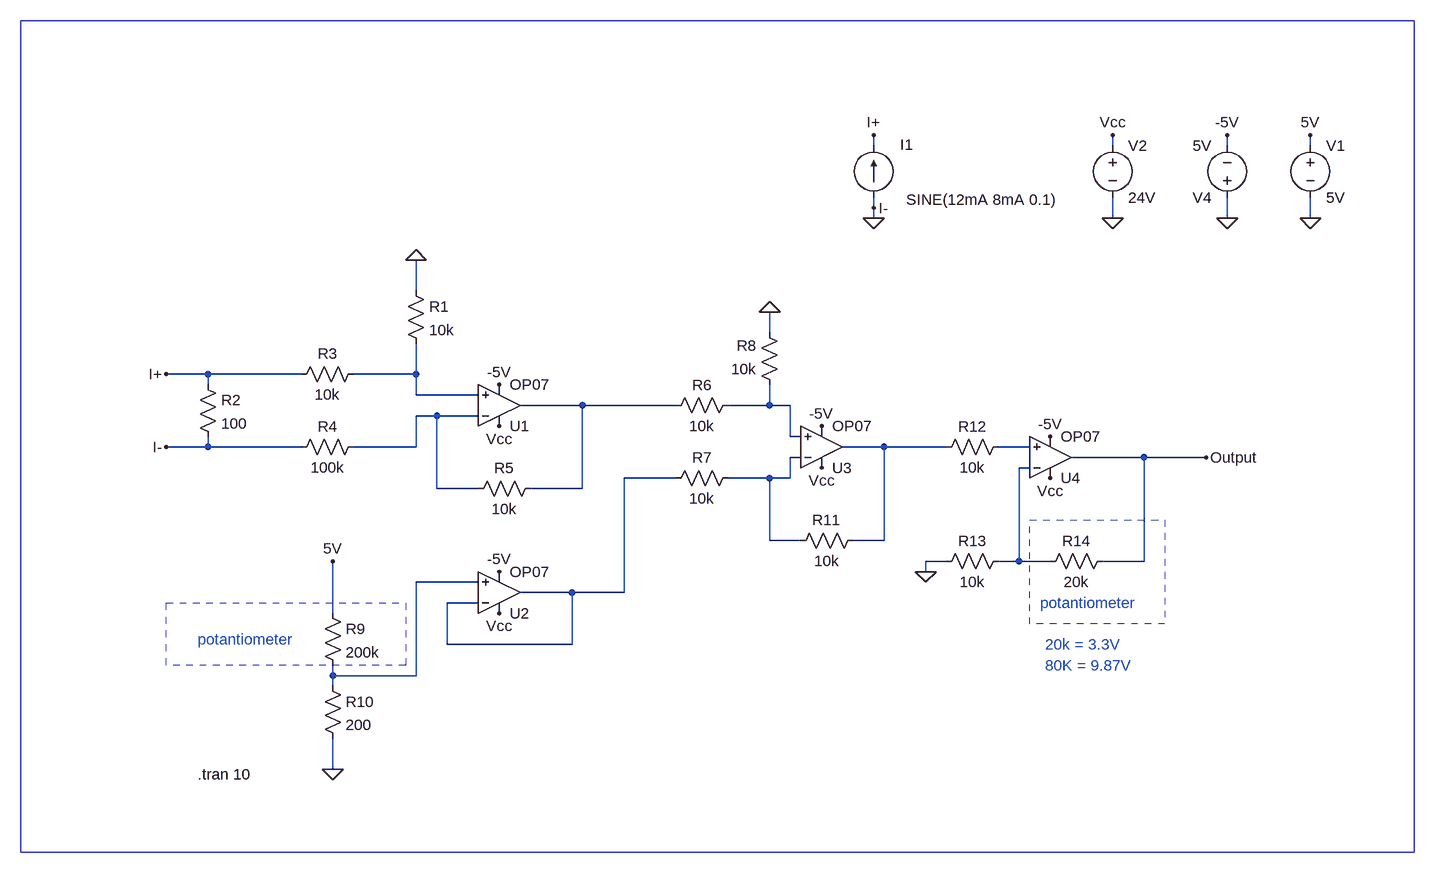
[diagram p0: schematic HW-685.asc]
HW-685.asc, the LTspice schematic file:
Version 4.1
SHEET 1 1764 868
WIRE 736 -224 736 -240
WIRE 1104 -224 1104 -240
WIRE 1280 -224 1280 -240
WIRE 1408 -224 1408 -240
WIRE 736 -128 736 -144
WIRE 736 -112 736 -128
WIRE 1104 -112 1104 -144
WIRE 1280 -112 1280 -144
WIRE 1408 -112 1408 -144
WIRE 32 0 32 -48
WIRE 576 64 576 32
WIRE -288 128 -352 128
WIRE -144 128 -288 128
WIRE 32 128 32 80
WIRE 32 128 -64 128
WIRE -288 144 -288 128
WIRE 32 160 32 128
WIRE 128 160 32 160
WIRE 288 176 192 176
WIRE 432 176 288 176
WIRE 576 176 576 144
WIRE 576 176 512 176
WIRE 608 176 576 176
WIRE 64 192 32 192
WIRE 128 192 64 192
WIRE 608 224 608 176
WIRE 624 224 608 224
WIRE -288 240 -288 224
WIRE -288 240 -352 240
WIRE -144 240 -288 240
WIRE 32 240 32 192
WIRE 32 240 -64 240
WIRE 752 240 688 240
WIRE 848 240 752 240
WIRE 976 240 928 240
WIRE 624 256 608 256
WIRE 1152 256 1040 256
WIRE 1248 256 1152 256
WIRE 976 272 960 272
WIRE 432 288 352 288
WIRE 576 288 512 288
WIRE 608 288 608 256
WIRE 608 288 576 288
WIRE 64 304 64 192
WIRE 128 304 64 304
WIRE 288 304 288 176
WIRE 288 304 208 304
WIRE 576 384 576 288
WIRE 624 384 576 384
WIRE 752 384 752 240
WIRE 752 384 704 384
WIRE 848 416 816 416
WIRE 960 416 960 272
WIRE 960 416 928 416
WIRE 1008 416 960 416
WIRE 1152 416 1152 256
WIRE 1152 416 1088 416
WIRE 816 432 816 416
WIRE 128 448 32 448
WIRE 272 464 192 464
WIRE 352 464 352 288
WIRE 352 464 272 464
WIRE 128 480 80 480
WIRE -96 496 -96 416
WIRE 80 544 80 480
WIRE 272 544 272 464
WIRE 272 544 80 544
WIRE -96 592 -96 576
WIRE 32 592 32 448
WIRE 32 592 -96 592
WIRE -96 608 -96 592
WIRE -96 736 -96 688
FLAG 32 -48 0
FLAG 576 32 0
FLAG -96 416 5V
FLAG -96 736 0
FLAG 816 432 0
FLAG 1248 256 Output
FLAG -352 128 I+
FLAG -352 240 I-
FLAG 736 -112 0
FLAG 736 -240 I+
FLAG 736 -128 I-
FLAG 1104 -240 Vcc
FLAG 1104 -112 0
FLAG 160 144 -5V
FLAG 1008 224 -5V
FLAG 656 208 -5V
FLAG 160 432 -5V
FLAG 1280 -240 -5V
FLAG 1280 -112 0
FLAG 160 208 Vcc
FLAG 656 272 Vcc
FLAG 1008 288 Vcc
FLAG 160 496 Vcc
FLAG 1408 -112 0
FLAG 1408 -240 5V
SYMBOL res 16 -16 R0
SYMATTR InstName R1
SYMATTR Value 10k
SYMBOL res -304 128 R0
SYMATTR InstName R2
SYMATTR Value 100
SYMBOL res -48 112 R90
WINDOW 0 0 56 VBottom 2
WINDOW 3 32 56 VTop 2
SYMATTR InstName R3
SYMATTR Value 10k
SYMBOL res -48 224 R90
WINDOW 0 0 56 VBottom 2
WINDOW 3 32 56 VTop 2
SYMATTR InstName R4
SYMATTR Value 100k
SYMBOL res 224 288 R90
WINDOW 0 0 56 VBottom 2
WINDOW 3 32 56 VTop 2
SYMATTR InstName R5
SYMATTR Value 10k
SYMBOL res 528 160 R90
WINDOW 0 0 56 VBottom 2
WINDOW 3 32 56 VTop 2
SYMATTR InstName R6
SYMATTR Value 10k
SYMBOL res 528 272 R90
WINDOW 0 0 56 VBottom 2
WINDOW 3 32 56 VTop 2
SYMATTR InstName R7
SYMATTR Value 10k
SYMBOL res 592 160 R180
WINDOW 0 36 76 Left 2
WINDOW 3 36 40 Left 2
SYMATTR InstName R8
SYMATTR Value 10k
SYMBOL res -112 480 R0
SYMATTR InstName R9
SYMATTR Value 200k
SYMBOL res -112 592 R0
SYMATTR InstName R10
SYMATTR Value 200
SYMBOL res 720 368 R90
WINDOW 0 0 56 VBottom 2
WINDOW 3 32 56 VTop 2
SYMATTR InstName R11
SYMATTR Value 10k
SYMBOL res 944 224 R90
WINDOW 0 0 56 VBottom 2
WINDOW 3 32 56 VTop 2
SYMATTR InstName R12
SYMATTR Value 10k
SYMBOL res 944 400 R90
WINDOW 0 0 56 VBottom 2
WINDOW 3 32 56 VTop 2
SYMATTR InstName R13
SYMATTR Value 10k
SYMBOL res 1104 400 R90
WINDOW 0 0 56 VBottom 2
WINDOW 3 32 56 VTop 2
SYMATTR InstName R14
SYMATTR Value 20k
SYMBOL current 736 -144 R180
WINDOW 123 0 0 Left 0
WINDOW 39 0 0 Left 0
WINDOW 0 -61 81 Left 2
WINDOW 3 -282 -3 Left 2
SYMATTR InstName I1
SYMATTR Value SINE(12mA 8mA 0.1)
SYMBOL voltage 1104 -240 R0
WINDOW 123 0 0 Left 0
WINDOW 39 0 0 Left 0
SYMATTR InstName V2
SYMATTR Value 24V
SYMBOL voltage 1280 -128 R180
WINDOW 123 0 0 Left 0
WINDOW 39 0 0 Left 0
SYMATTR InstName V4
SYMATTR Value 5V
SYMBOL OpAmps\\OP07 160 240 M180
SYMATTR InstName U1
SYMBOL OpAmps\\OP07 160 528 M180
SYMATTR InstName U2
SYMBOL OpAmps\\OP07 656 304 M180
SYMATTR InstName U3
SYMBOL OpAmps\\OP07 1008 320 M180
SYMATTR InstName U4
SYMBOL voltage 1408 -240 R0
WINDOW 123 0 0 Left 0
WINDOW 39 0 0 Left 0
SYMATTR InstName V1
SYMATTR Value 5V
TEXT -304 536 Left 2 ;potantiometer
TEXT 992 480 Left 2 ;potantiometer
TEXT -304 744 Left 2 !.tran 10
TEXT 1000 544 Left 2 ;20k = 3.3V
TEXT 1000 576 Left 2 ;80K = 9.87V
RECTANGLE Normal 1184 512 976 352 1
RECTANGLE Normal -352 480 16 576 1
RECTANGLE Normal 1568 864 -576 -416

The netlist it stands for:
* HW-685.asc
R1 0 N001 10k
R2 I+ 0 100
R3 N001 I+ 10k
R4 N004 0 100k
R5 N002 N004 10k
R6 N003 N002 10k
R7 N007 N009 10k
R8 N003 0 10k
R9 5V N010 200k
R10 N010 0 200
R11 N005 N007 10k
R12 N006 N005 10k
R13 N008 0 10k
R14 Output N008 20k
I1 0 I+ SINE(12mA 8mA 0.1)
V2 Vcc 0 24V
V4 0 -5V 5V
X§U1 N001 N004 Vcc -5V N002 LT1001  ; OP07, pins In+ In- V+ V- OUT
X§U2 N010 N009 Vcc -5V N009 LT1001  ; OP07, pins In+ In- V+ V- OUT
X§U3 N003 N007 Vcc -5V N005 LT1001  ; OP07, pins In+ In- V+ V- OUT
X§U4 N006 N008 Vcc -5V Output LT1001  ; OP07, pins In+ In- V+ V- OUT
V1 5V 0 5V
* potantiometer
* potantiometer
.tran 10
* 20k = 3.3V
* 80K = 9.87V
.lib LTC.lib
.backanno
.end